# EAGLE design icyradio-exp-mmw-int-rf (EAGLE 9.6.2)
CREVISION: 1; DESIGNER: Joao Silva

## Sheet 1 of 3: Upconverter
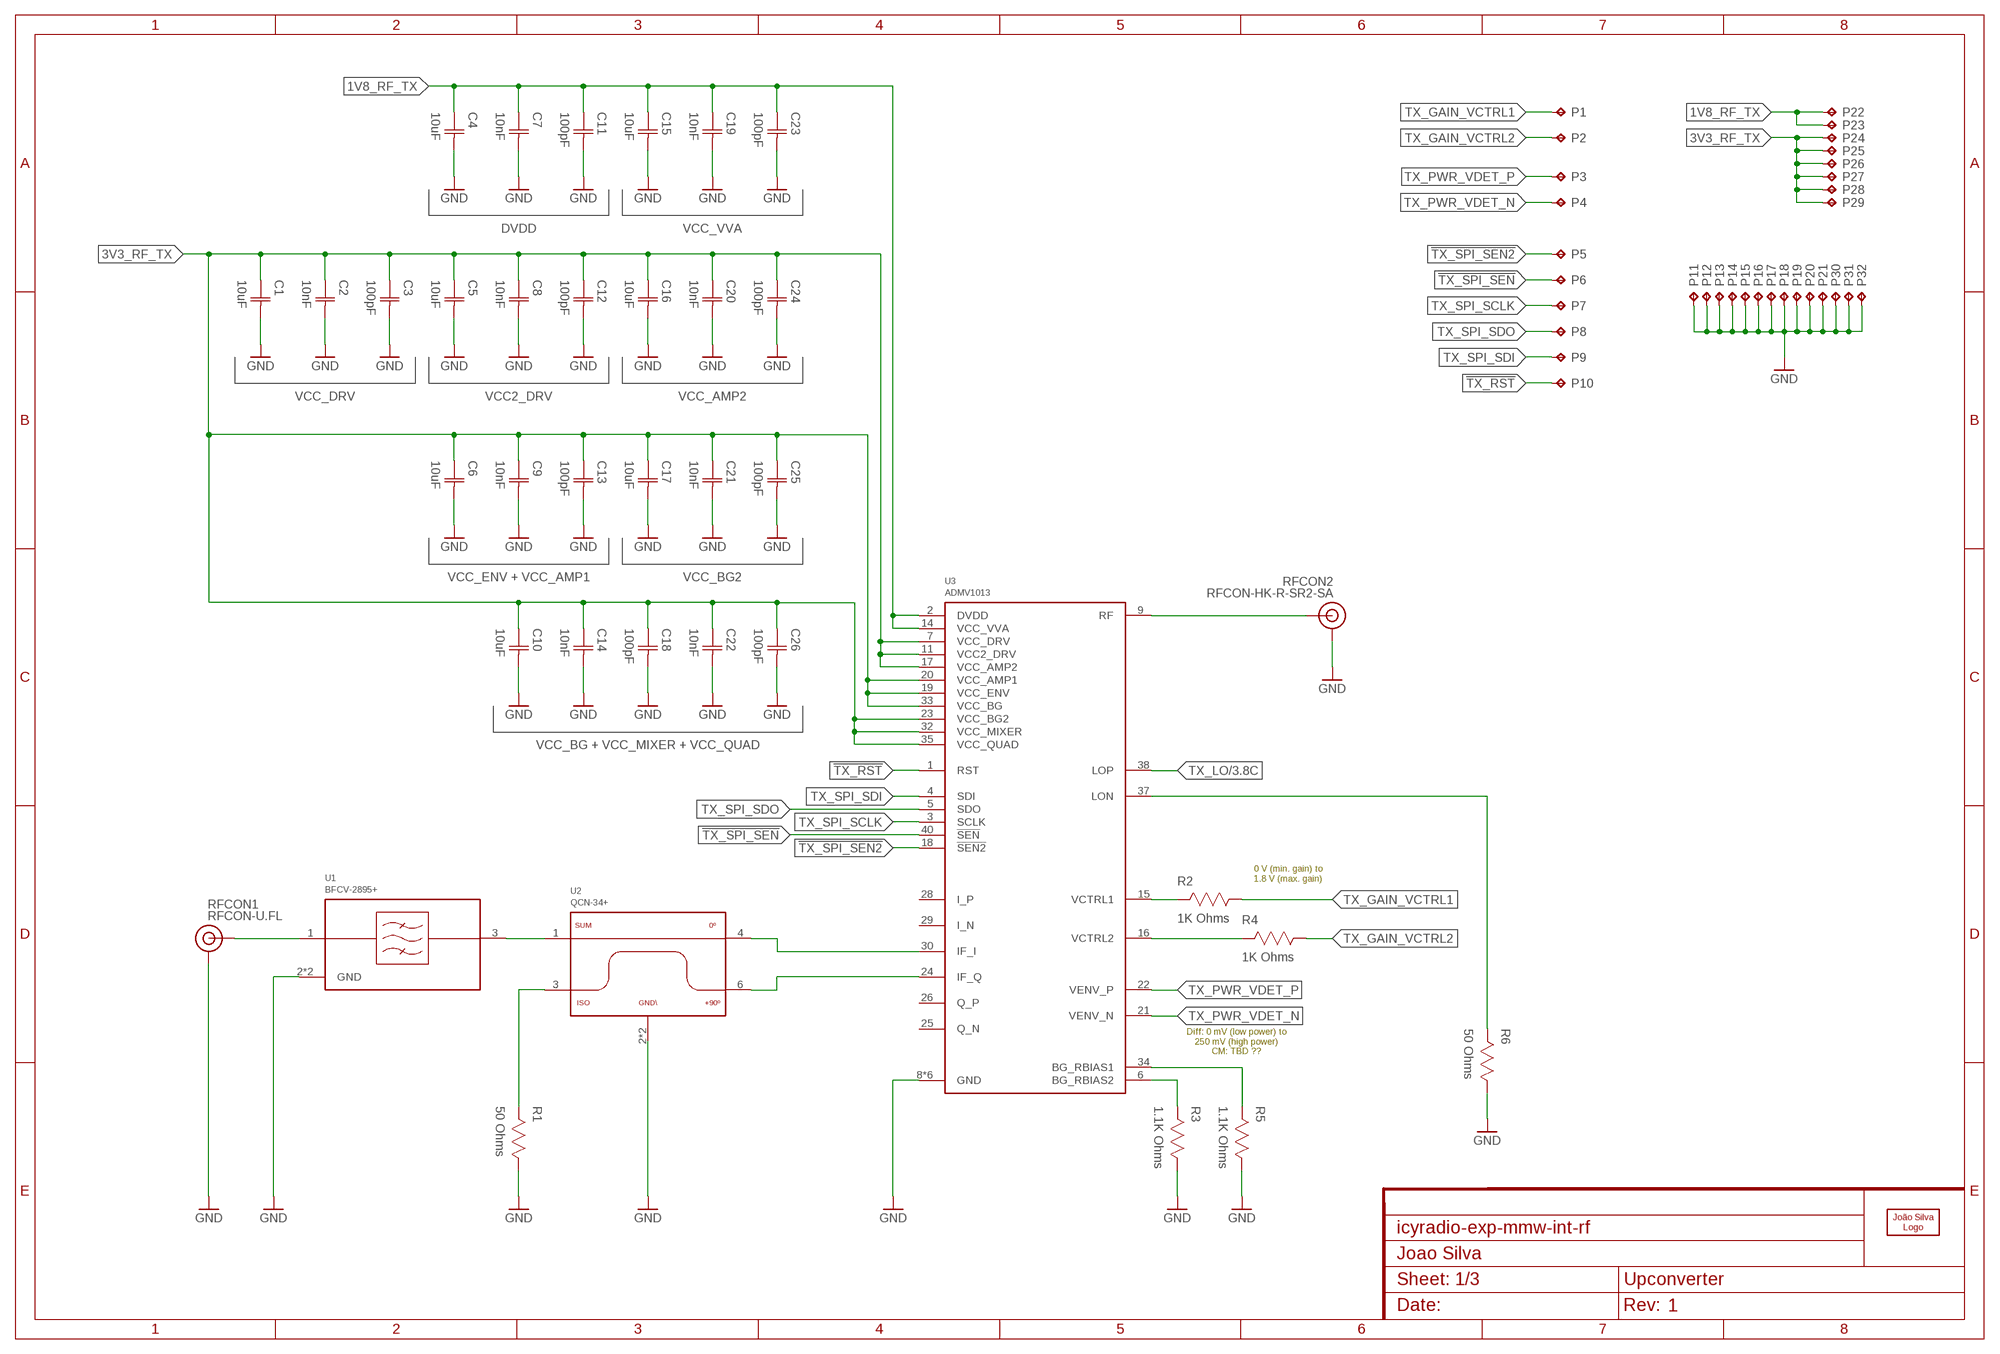
[diagram p0: schematic, sheet 1]

### Parts
C1  10uF  CAPACITOR-0402  [CAP0402]
C2  10nF  CAPACITOR-0402  [CAP0402]
C3  100pF  CAPACITOR-0402  [CAP0402]
C4  10uF  CAPACITOR-0402  [CAP0402]
C5  10uF  CAPACITOR-0402  [CAP0402]
C6  10uF  CAPACITOR-0402  [CAP0402]
C7  10nF  CAPACITOR-0402  [CAP0402]
C8  10nF  CAPACITOR-0402  [CAP0402]
C9  10nF  CAPACITOR-0402  [CAP0402]
C10  10uF  CAPACITOR-0402  [CAP0402]
C11  100pF  CAPACITOR-0402  [CAP0402]
C12  100pF  CAPACITOR-0402  [CAP0402]
C13  100pF  CAPACITOR-0402  [CAP0402]
C14  10nF  CAPACITOR-0402  [CAP0402]
C15  10uF  CAPACITOR-0402  [CAP0402]
C16  10uF  CAPACITOR-0402  [CAP0402]
C17  10uF  CAPACITOR-0402  [CAP0402]
C18  100pF  CAPACITOR-0402  [CAP0402]
C19  10nF  CAPACITOR-0402  [CAP0402]
C20  10nF  CAPACITOR-0402  [CAP0402]
C21  10nF  CAPACITOR-0402  [CAP0402]
C22  10nF  CAPACITOR-0402  [CAP0402]
C23  100pF  CAPACITOR-0402  [CAP0402]
C24  100pF  CAPACITOR-0402  [CAP0402]
C25  100pF  CAPACITOR-0402  [CAP0402]
C26  100pF  CAPACITOR-0402  [CAP0402]
LOGO1  JSILVA-5MM  [JSILVA_5MM]
P1  CHOLE-0.9MM-SS  [CAST_HOLE_0P9MM_SS]
P2  CHOLE-0.9MM-SS  [CAST_HOLE_0P9MM_SS]
P3  CHOLE-0.9MM-SS  [CAST_HOLE_0P9MM_SS]
P4  CHOLE-0.9MM-SS  [CAST_HOLE_0P9MM_SS]
P5  CHOLE-0.9MM-SS  [CAST_HOLE_0P9MM_SS]
P6  CHOLE-0.9MM-SS  [CAST_HOLE_0P9MM_SS]
P7  CHOLE-0.9MM-SS  [CAST_HOLE_0P9MM_SS]
P8  CHOLE-0.9MM-SS  [CAST_HOLE_0P9MM_SS]
P9  CHOLE-0.9MM-SS  [CAST_HOLE_0P9MM_SS]
P10  CHOLE-0.9MM-SS  [CAST_HOLE_0P9MM_SS]
P11  CHOLE-0.9MM-DS  [CAST_HOLE_0P9MM_DS]
P12  CHOLE-0.9MM-DS  [CAST_HOLE_0P9MM_DS]
P13  CHOLE-0.9MM-DS  [CAST_HOLE_0P9MM_DS]
P14  CHOLE-0.9MM-DS  [CAST_HOLE_0P9MM_DS]
P15  CHOLE-0.9MM-DS  [CAST_HOLE_0P9MM_DS]
P16  CHOLE-0.9MM-DS  [CAST_HOLE_0P9MM_DS]
P17  CHOLE-0.9MM-DS  [CAST_HOLE_0P9MM_DS]
P18  CHOLE-0.9MM-DS  [CAST_HOLE_0P9MM_DS]
P19  CHOLE-0.9MM-DS  [CAST_HOLE_0P9MM_DS]
P20  CHOLE-0.9MM-DS  [CAST_HOLE_0P9MM_DS]
P21  CHOLE-0.9MM-DS  [CAST_HOLE_0P9MM_DS]
P22  CHOLE-0.9MM-SS  [CAST_HOLE_0P9MM_SS]
P23  CHOLE-0.9MM-SS  [CAST_HOLE_0P9MM_SS]
P24  CHOLE-0.9MM-SS  [CAST_HOLE_0P9MM_SS]
P25  CHOLE-0.9MM-SS  [CAST_HOLE_0P9MM_SS]
P26  CHOLE-0.9MM-SS  [CAST_HOLE_0P9MM_SS]
P27  CHOLE-0.9MM-SS  [CAST_HOLE_0P9MM_SS]
P28  CHOLE-0.9MM-SS  [CAST_HOLE_0P9MM_SS]
P29  CHOLE-0.9MM-SS  [CAST_HOLE_0P9MM_SS]
P30  CHOLE-0.9MM-DS  [CAST_HOLE_0P9MM_DS]
P31  CHOLE-0.9MM-DS  [CAST_HOLE_0P9MM_DS]
P32  CHOLE-0.9MM-DS  [CAST_HOLE_0P9MM_DS]
R1  50 Ohms  RESISTOR-0402  [RES0402]
R2  1K Ohms  RESISTOR-0402  [RES0402]
R3  1.1K Ohms  RESISTOR-0402  [RES0402]
R4  1K Ohms  RESISTOR-0402  [RES0402]
R5  1.1K Ohms  RESISTOR-0402  [RES0402]
R6  50 Ohms  RESISTOR-0402  [RES0402]
RFCON1  RFCON-U.FL  [U.FL]
RFCON2  RFCON-HK-R-SR2-SA  [HK-R-SR2-SA]
U1  BFCV-2895+  [JV1210C]
U2  QCN-34+  [FV1206-1]
U3  ADMV1013  [LGA40]

### Nets
1V8_RF_TX: C4.1(C1) C7.1(C1) C11.1(C1) C15.1(C1) C19.1(C1) C23.1(C1) P22.PAD_T(TP) P23.PAD_T(TP) U3.2(DVDD) U3.14(VCC_VVA)
3V3_RF_TX: C1.1(C1) C2.1(C1) C3.1(C1) C5.1(C1) C6.1(C1) C8.1(C1) C9.1(C1) C10.1(C1) C12.1(C1) C13.1(C1) C14.1(C1) C16.1(C1) C17.1(C1) C18.1(C1) C20.1(C1) C21.1(C1) C22.1(C1) C24.1(C1) C25.1(C1) C26.1(C1) P24.PAD_T(TP) P25.PAD_T(TP) P26.PAD_T(TP) P27.PAD_T(TP) P28.PAD_T(TP) P29.PAD_T(TP) U3.7(VCC_DRV) U3.11(VCC2_DRV) U3.17(VCC_AMP2) U3.19(VCC_ENV) U3.20(VCC_AMP1) U3.23(VCC_BG2) U3.32(VCC_MIXER) U3.33(VCC_BG) U3.35(VCC_QUAD)
!TX_RST: P10.PAD_T(TP) U3.1(RST)
!TX_SPI_SEN: P6.PAD_T(TP) U3.40(!SEN)
!TX_SPI_SEN2: P5.PAD_T(TP) U3.18(!SEN2)
GND: C1.2(C2) C2.2(C2) C3.2(C2) C4.2(C2) C5.2(C2) C6.2(C2) C7.2(C2) C8.2(C2) C9.2(C2) C10.2(C2) C11.2(C2) C12.2(C2) C13.2(C2) C14.2(C2) C15.2(C2) C16.2(C2) C17.2(C2) C18.2(C2) C19.2(C2) C20.2(C2) C21.2(C2) C22.2(C2) C23.2(C2) C24.2(C2) C25.2(C2) C26.2(C2) P11.PAD_B(TP) P11.PAD_T(TP) P12.PAD_B(TP) P12.PAD_T(TP) P13.PAD_B(TP) P13.PAD_T(TP) P14.PAD_B(TP) P14.PAD_T(TP) P15.PAD_B(TP) P15.PAD_T(TP) P16.PAD_B(TP) P16.PAD_T(TP) P17.PAD_B(TP) P17.PAD_T(TP) P18.PAD_B(TP) P18.PAD_T(TP) P19.PAD_B(TP) P19.PAD_T(TP) P20.PAD_B(TP) P20.PAD_T(TP) P21.PAD_B(TP) P21.PAD_T(TP) P30.PAD_B(TP) P30.PAD_T(TP) P31.PAD_B(TP) P31.PAD_T(TP) P32.PAD_B(TP) P32.PAD_T(TP) R1.1 R3.1 R5.1 R6.1 RFCON1.P$1(GND) RFCON1.P$2(GND) RFCON2.GND@1(GND) RFCON2.GND@2(GND) U1.2(GND) U1.4(GND) U2.2(GND) U2.5(GND) U3.8(GND) U3.10(GND) U3.27(GND) U3.36(GND) U3.39(GND) U3.41(GND) ; also sheet 2,3
N$5: R3.2 U3.6(BG_RBIAS2)
N$6: R5.2 U3.34(BG_RBIAS1)
N$11: R1.2 U2.3(ISO)
N$17: R2.2 U3.15(VCTRL1)
N$18: R4.2 U3.16(VCTRL2)
TX_GAIN_VCTRL1: P1.PAD_T(TP) R2.1
TX_GAIN_VCTRL2: P2.PAD_T(TP) R4.1
TX_IF_FILT: U1.3(RFOUT) U2.1(SUM)
TX_IF_I: U2.4(0DEG) U3.30(IF_I)
TX_IF_IN: RFCON1.P$3(SIGNAL) U1.1(RFIN)
TX_IF_Q: U2.6(P90DEG) U3.24(IF_Q)
TX_LO: U3.38(LOP) ; also sheet 3
TX_LO_N: R6.2 U3.37(LON)
TX_PWR_VDET_N: P4.PAD_T(TP) U3.21(VENV_N)
TX_PWR_VDET_P: P3.PAD_T(TP) U3.22(VENV_P)
TX_RF: RFCON2.SIG(SIGNAL) U3.9(RF)
TX_SPI_SCLK: P7.PAD_T(TP) U3.3(SCLK)
TX_SPI_SDI: P9.PAD_T(TP) U3.4(SDI)
TX_SPI_SDO: P8.PAD_T(TP) U3.5(SDO)
Unconnected: U3.25(Q_N) U3.26(Q_P) U3.28(I_P) U3.29(I_N)

### Notes on the sheet
- DVDD | VCC_VVA
- VCC_DRV | VCC2_DRV | VCC_AMP2
- VCC_ENV + VCC_AMP1 | VCC_BG2
- VCC_BG + VCC_MIXER + VCC_QUAD
- 0 V (min. gain) to
  1.8 V (max. gain)
- Diff: 0 mV (low power) to
  250 mV (high power)
  CM: TBD ??

## Sheet 2 of 3: Downconverter
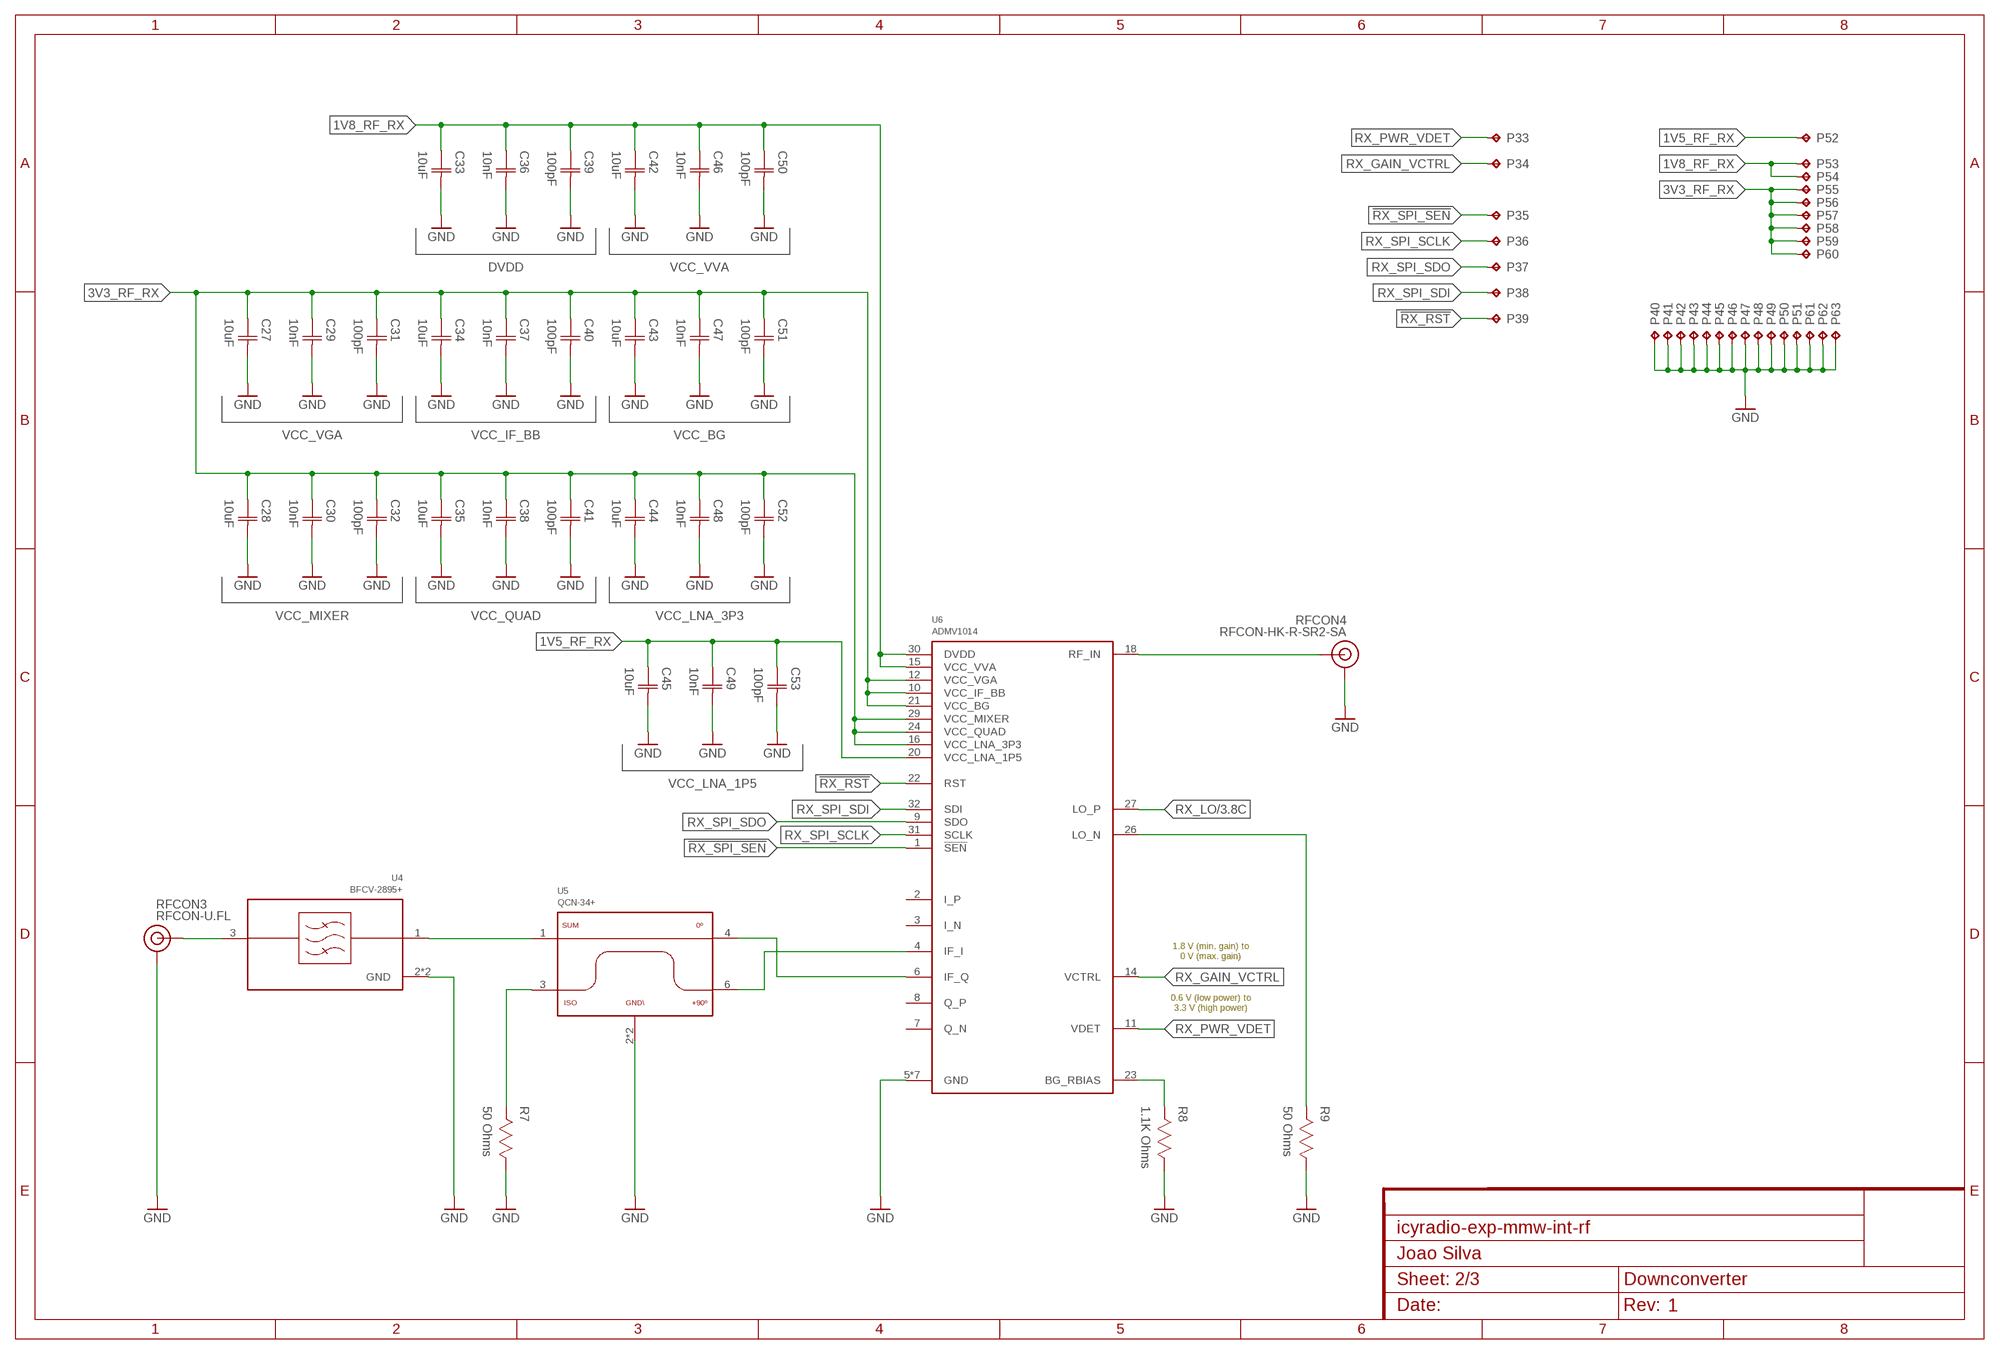
[diagram p1: schematic, sheet 2]

### Parts
C27  10uF  CAPACITOR-0402  [CAP0402]
C28  10uF  CAPACITOR-0402  [CAP0402]
C29  10nF  CAPACITOR-0402  [CAP0402]
C30  10nF  CAPACITOR-0402  [CAP0402]
C31  100pF  CAPACITOR-0402  [CAP0402]
C32  100pF  CAPACITOR-0402  [CAP0402]
C33  10uF  CAPACITOR-0402  [CAP0402]
C34  10uF  CAPACITOR-0402  [CAP0402]
C35  10uF  CAPACITOR-0402  [CAP0402]
C36  10nF  CAPACITOR-0402  [CAP0402]
C37  10nF  CAPACITOR-0402  [CAP0402]
C38  10nF  CAPACITOR-0402  [CAP0402]
C39  100pF  CAPACITOR-0402  [CAP0402]
C40  100pF  CAPACITOR-0402  [CAP0402]
C41  100pF  CAPACITOR-0402  [CAP0402]
C42  10uF  CAPACITOR-0402  [CAP0402]
C43  10uF  CAPACITOR-0402  [CAP0402]
C44  10uF  CAPACITOR-0402  [CAP0402]
C45  10uF  CAPACITOR-0402  [CAP0402]
C46  10nF  CAPACITOR-0402  [CAP0402]
C47  10nF  CAPACITOR-0402  [CAP0402]
C48  10nF  CAPACITOR-0402  [CAP0402]
C49  10nF  CAPACITOR-0402  [CAP0402]
C50  100pF  CAPACITOR-0402  [CAP0402]
C51  100pF  CAPACITOR-0402  [CAP0402]
C52  100pF  CAPACITOR-0402  [CAP0402]
C53  100pF  CAPACITOR-0402  [CAP0402]
P33  CHOLE-0.9MM-SS  [CAST_HOLE_0P9MM_SS]
P34  CHOLE-0.9MM-SS  [CAST_HOLE_0P9MM_SS]
P35  CHOLE-0.9MM-SS  [CAST_HOLE_0P9MM_SS]
P36  CHOLE-0.9MM-SS  [CAST_HOLE_0P9MM_SS]
P37  CHOLE-0.9MM-SS  [CAST_HOLE_0P9MM_SS]
P38  CHOLE-0.9MM-SS  [CAST_HOLE_0P9MM_SS]
P39  CHOLE-0.9MM-SS  [CAST_HOLE_0P9MM_SS]
P40  CHOLE-0.9MM-DS  [CAST_HOLE_0P9MM_DS]
P41  CHOLE-0.9MM-DS  [CAST_HOLE_0P9MM_DS]
P42  CHOLE-0.9MM-DS  [CAST_HOLE_0P9MM_DS]
P43  CHOLE-0.9MM-DS  [CAST_HOLE_0P9MM_DS]
P44  CHOLE-0.9MM-DS  [CAST_HOLE_0P9MM_DS]
P45  CHOLE-0.9MM-DS  [CAST_HOLE_0P9MM_DS]
P46  CHOLE-0.9MM-DS  [CAST_HOLE_0P9MM_DS]
P47  CHOLE-0.9MM-DS  [CAST_HOLE_0P9MM_DS]
P48  CHOLE-0.9MM-DS  [CAST_HOLE_0P9MM_DS]
P49  CHOLE-0.9MM-DS  [CAST_HOLE_0P9MM_DS]
P50  CHOLE-0.9MM-DS  [CAST_HOLE_0P9MM_DS]
P51  CHOLE-0.9MM-DS  [CAST_HOLE_0P9MM_DS]
P52  CHOLE-0.9MM-SS  [CAST_HOLE_0P9MM_SS]
P53  CHOLE-0.9MM-SS  [CAST_HOLE_0P9MM_SS]
P54  CHOLE-0.9MM-SS  [CAST_HOLE_0P9MM_SS]
P55  CHOLE-0.9MM-SS  [CAST_HOLE_0P9MM_SS]
P56  CHOLE-0.9MM-SS  [CAST_HOLE_0P9MM_SS]
P57  CHOLE-0.9MM-SS  [CAST_HOLE_0P9MM_SS]
P58  CHOLE-0.9MM-SS  [CAST_HOLE_0P9MM_SS]
P59  CHOLE-0.9MM-SS  [CAST_HOLE_0P9MM_SS]
P60  CHOLE-0.9MM-SS  [CAST_HOLE_0P9MM_SS]
P61  CHOLE-0.9MM-DS  [CAST_HOLE_0P9MM_DS]
P62  CHOLE-0.9MM-DS  [CAST_HOLE_0P9MM_DS]
P63  CHOLE-0.9MM-DS  [CAST_HOLE_0P9MM_DS]
R7  50 Ohms  RESISTOR-0402  [RES0402]
R8  1.1K Ohms  RESISTOR-0402  [RES0402]
R9  50 Ohms  RESISTOR-0402  [RES0402]
RFCON3  RFCON-U.FL  [U.FL]
RFCON4  RFCON-HK-R-SR2-SA  [HK-R-SR2-SA]
U4  BFCV-2895+  [JV1210C]
U5  QCN-34+  [FV1206-1]
U6  ADMV1014  [LGA32]

### Nets
1V5_RF_RX: C45.1(C1) C49.1(C1) C53.1(C1) P52.PAD_T(TP) U6.20(VCC_LNA_1P5)
1V8_RF_RX: C33.1(C1) C36.1(C1) C39.1(C1) C42.1(C1) C46.1(C1) C50.1(C1) P53.PAD_T(TP) P54.PAD_T(TP) U6.15(VCC_VVA) U6.30(DVDD)
3V3_RF_RX: C27.1(C1) C28.1(C1) C29.1(C1) C30.1(C1) C31.1(C1) C32.1(C1) C34.1(C1) C35.1(C1) C37.1(C1) C38.1(C1) C40.1(C1) C41.1(C1) C43.1(C1) C44.1(C1) C47.1(C1) C48.1(C1) C51.1(C1) C52.1(C1) P55.PAD_T(TP) P56.PAD_T(TP) P57.PAD_T(TP) P58.PAD_T(TP) P59.PAD_T(TP) P60.PAD_T(TP) U6.10(VCC_IF_BB) U6.12(VCC_VGA) U6.16(VCC_LNA_3P3) U6.21(VCC_BG) U6.24(VCC_QUAD) U6.29(VCC_MIXER)
!RX_RST: P39.PAD_T(TP) U6.22(RST)
!RX_SPI_SEN: P35.PAD_T(TP) U6.1(!SEN)
GND: C27.2(C2) C28.2(C2) C29.2(C2) C30.2(C2) C31.2(C2) C32.2(C2) C33.2(C2) C34.2(C2) C35.2(C2) C36.2(C2) C37.2(C2) C38.2(C2) C39.2(C2) C40.2(C2) C41.2(C2) C42.2(C2) C43.2(C2) C44.2(C2) C45.2(C2) C46.2(C2) C47.2(C2) C48.2(C2) C49.2(C2) C50.2(C2) C51.2(C2) C52.2(C2) C53.2(C2) P40.PAD_B(TP) P40.PAD_T(TP) P41.PAD_B(TP) P41.PAD_T(TP) P42.PAD_B(TP) P42.PAD_T(TP) P43.PAD_B(TP) P43.PAD_T(TP) P44.PAD_B(TP) P44.PAD_T(TP) P45.PAD_B(TP) P45.PAD_T(TP) P46.PAD_B(TP) P46.PAD_T(TP) P47.PAD_B(TP) P47.PAD_T(TP) P48.PAD_B(TP) P48.PAD_T(TP) P49.PAD_B(TP) P49.PAD_T(TP) P50.PAD_B(TP) P50.PAD_T(TP) P51.PAD_B(TP) P51.PAD_T(TP) P61.PAD_B(TP) P61.PAD_T(TP) P62.PAD_B(TP) P62.PAD_T(TP) P63.PAD_B(TP) P63.PAD_T(TP) R7.1 R8.1 R9.1 RFCON3.P$1(GND) RFCON3.P$2(GND) RFCON4.GND@1(GND) RFCON4.GND@2(GND) U4.2(GND) U4.4(GND) U5.2(GND) U5.5(GND) U6.5(GND) U6.13(GND) U6.17(GND) U6.19(GND) U6.25(GND) U6.28(GND) U6.33(GND) ; also sheet 1,3
N$9: R8.2 U6.23(BG_RBIAS)
N$13: R7.2 U5.3(ISO)
RX_GAIN_VCTRL: P34.PAD_T(TP) U6.14(VCTRL)
RX_IF: U4.1(RFIN) U5.1(SUM)
RX_IF_FILT: RFCON3.P$3(SIGNAL) U4.3(RFOUT)
RX_IF_I: U5.6(P90DEG) U6.4(IF_I)
RX_IF_Q: U5.4(0DEG) U6.6(IF_Q)
RX_LO: U6.27(LO_P) ; also sheet 3
RX_LO_N: R9.2 U6.26(LO_N)
RX_PWR_VDET: P33.PAD_T(TP) U6.11(VDET)
RX_RF: RFCON4.SIG(SIGNAL) U6.18(RF_IN)
RX_SPI_SCLK: P36.PAD_T(TP) U6.31(SCLK)
RX_SPI_SDI: P38.PAD_T(TP) U6.32(SDI)
RX_SPI_SDO: P37.PAD_T(TP) U6.9(SDO)
Unconnected: U6.2(I_P) U6.3(I_N) U6.7(Q_N) U6.8(Q_P)

### Notes on the sheet
- DVDD | VCC_VVA
- VCC_VGA | VCC_IF_BB | VCC_BG
- VCC_MIXER | VCC_QUAD | VCC_LNA_3P3
- VCC_LNA_1P5
- 1.8 V (min. gain) to
  0 V (max. gain)
- 0.6 V (low power) to
  3.3 V (high power)

## Sheet 3 of 3: LO Conditioning
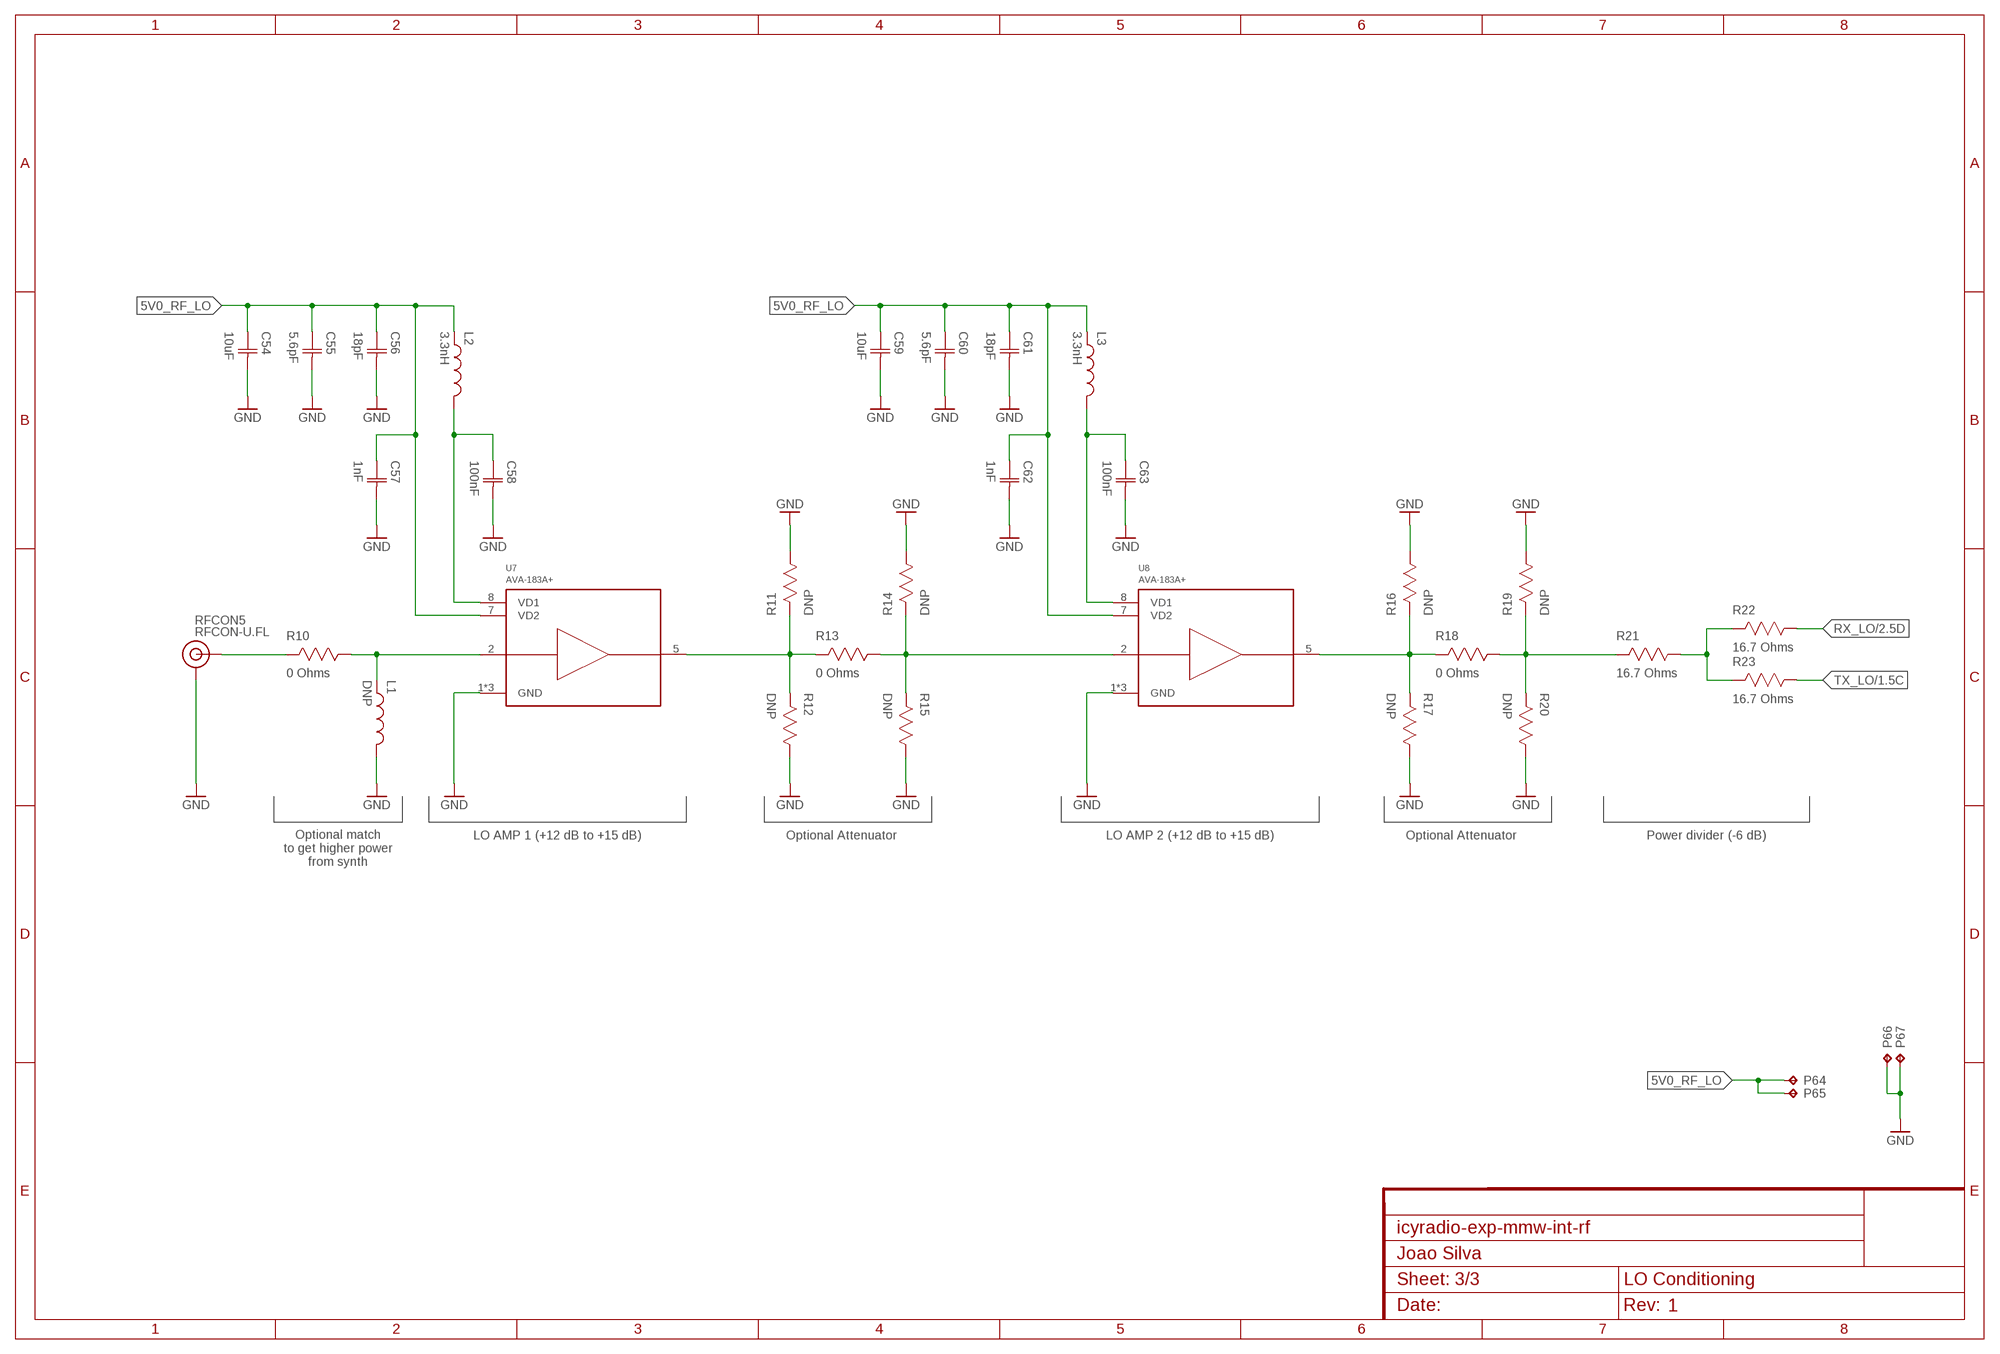
[diagram p2: schematic, sheet 3]

### Parts
C54  10uF  CAPACITOR-0402  [CAP0402]
C55  5.6pF  CAPACITOR-0402  [CAP0402]
C56  18pF  CAPACITOR-0402  [CAP0402]
C57  1nF  CAPACITOR-0402  [CAP0402]
C58  100nF  CAPACITOR-0402  [CAP0402]
C59  10uF  CAPACITOR-0402  [CAP0402]
C60  5.6pF  CAPACITOR-0402  [CAP0402]
C61  18pF  CAPACITOR-0402  [CAP0402]
C62  1nF  CAPACITOR-0402  [CAP0402]
C63  100nF  CAPACITOR-0402  [CAP0402]
L1  DNP  INDUCTOR-0402  [IND0402]
L2  3.3nH  INDUCTOR-0402  [IND0402]
L3  3.3nH  INDUCTOR-0402  [IND0402]
P64  CHOLE-0.9MM-SS  [CAST_HOLE_0P9MM_SS]
P65  CHOLE-0.9MM-SS  [CAST_HOLE_0P9MM_SS]
P66  CHOLE-0.9MM-DS  [CAST_HOLE_0P9MM_DS]
P67  CHOLE-0.9MM-DS  [CAST_HOLE_0P9MM_DS]
R10  0 Ohms  RESISTOR-0402  [RES0402]
R11  DNP  RESISTOR-0402  [RES0402]
R12  DNP  RESISTOR-0402  [RES0402]
R13  0 Ohms  RESISTOR-0402  [RES0402]
R14  DNP  RESISTOR-0402  [RES0402]
R15  DNP  RESISTOR-0402  [RES0402]
R16  DNP  RESISTOR-0402  [RES0402]
R17  DNP  RESISTOR-0402  [RES0402]
R18  0 Ohms  RESISTOR-0402  [RES0402]
R19  DNP  RESISTOR-0402  [RES0402]
R20  DNP  RESISTOR-0402  [RES0402]
R21  16.7 Ohms  RESISTOR-0402  [RES0402]
R22  16.7 Ohms  RESISTOR-0402  [RES0402]
R23  16.7 Ohms  RESISTOR-0402  [RES0402]
RFCON5  RFCON-U.FL  [U.FL]
U7  AVA-183A+  [DQ849]
U8  AVA-183A+  [DQ849]

### Nets
5V0_RF_LO: C54.1(C1) C55.1(C1) C56.1(C1) C57.1(C1) C59.1(C1) C60.1(C1) C61.1(C1) C62.1(C1) L2.1 L3.1 P64.PAD_T(TP) P65.PAD_T(TP) U7.7(VD2) U8.7(VD2)
GND: C54.2(C2) C55.2(C2) C56.2(C2) C57.2(C2) C58.2(C2) C59.2(C2) C60.2(C2) C61.2(C2) C62.2(C2) C63.2(C2) L1.2 P66.PAD_B(TP) P66.PAD_T(TP) P67.PAD_B(TP) P67.PAD_T(TP) R11.1 R12.1 R14.1 R15.1 R16.1 R17.1 R19.1 R20.1 RFCON5.P$1(GND) RFCON5.P$2(GND) U7.1(GND) U7.6(GND) U7.9(GND) U8.1(GND) U8.6(GND) U8.9(GND) ; also sheet 1,2
LO_AMP1_IN: L1.1 R10.1 U7.2(RFIN)
LO_AMP1_OUT: R11.2 R12.2 R13.2 U7.5(RFOUT)
LO_AMP2_IN: R13.1 R14.2 R15.2 U8.2(RFIN)
LO_AMP2_OUT: R16.2 R17.2 R18.2 U8.5(RFOUT)
LO_AMP_VD1: C58.1(C1) L2.2 U7.8(VD1)
LO_AMP_VD2: C63.1(C1) L3.2 U8.8(VD1)
LO_IN: R10.2 RFCON5.P$3(SIGNAL)
LO_OUT: R18.1 R19.2 R20.2 R21.2
LO_SPLIT: R21.1 R22.2 R23.2
RX_LO: R22.1 ; also sheet 2
TX_LO: R23.1 ; also sheet 1

### Notes on the sheet
- LO AMP 1 (+12 dB to +15 dB) | Optional Attenuator | LO AMP 2 (+12 dB to +15 dB) | Optional Attenuator | Power divider (-6 dB)
- Optional match
  to get higher power
  from synth

## Library data of the parts
C1-C63 = Capacitor:CAPACITOR
L1-L3 = Inductor:INDUCTOR; REF: 0402DC-3N3
LOGO1 = Silkscreen:JS
P1-P67 = PADs:CHOLE
R1-R23 = Resistor:RESISTOR
RFCON1-RFCON5 = RF Connector:RFCON
U1 U4 = Mini Circuits:BFCV-*+
U2 U5 = Mini Circuits:QCN-34*+
U3 = Analog Devices:ADMV1013
U6 = Analog Devices:ADMV1014
U7 U8 = Mini Circuits:AVA-183A+

## Net classes
1 CPWG 50 Ohm Single-Ended: width 0.2 mm, clearance 0.127 mm to class 0, clearance 0.127 mm

## Board
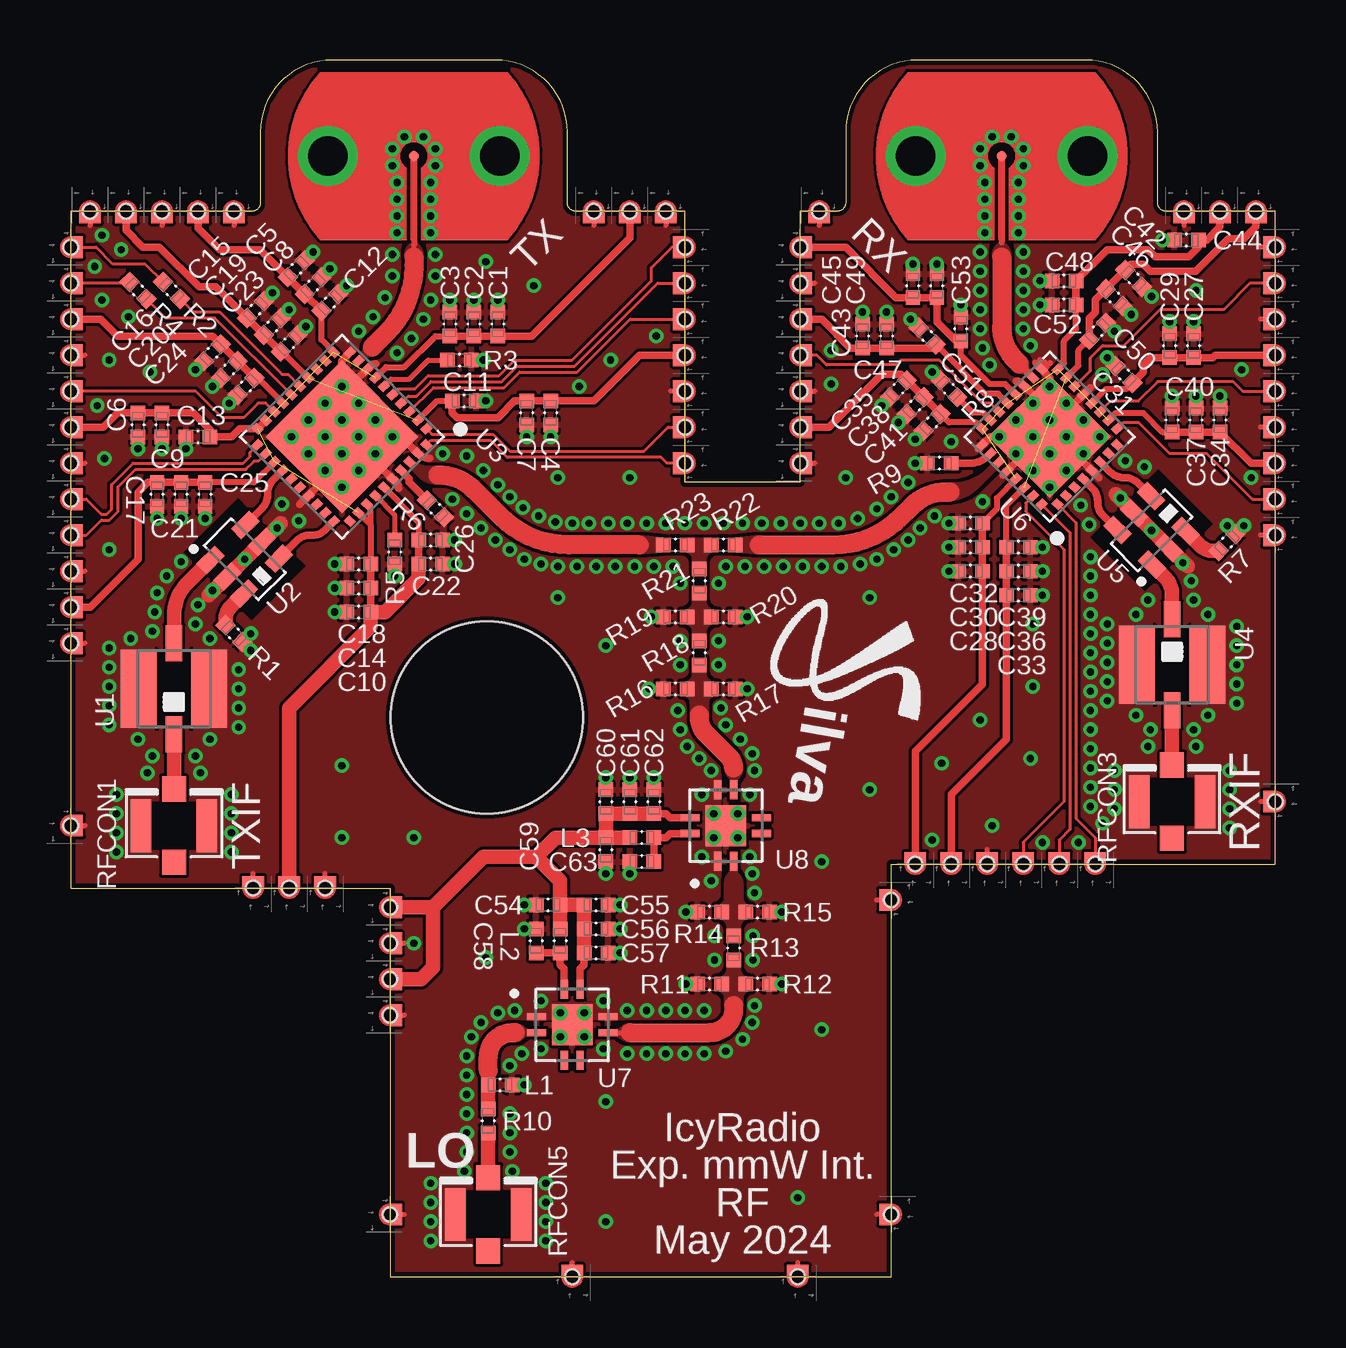
[diagram p3: board, top side]
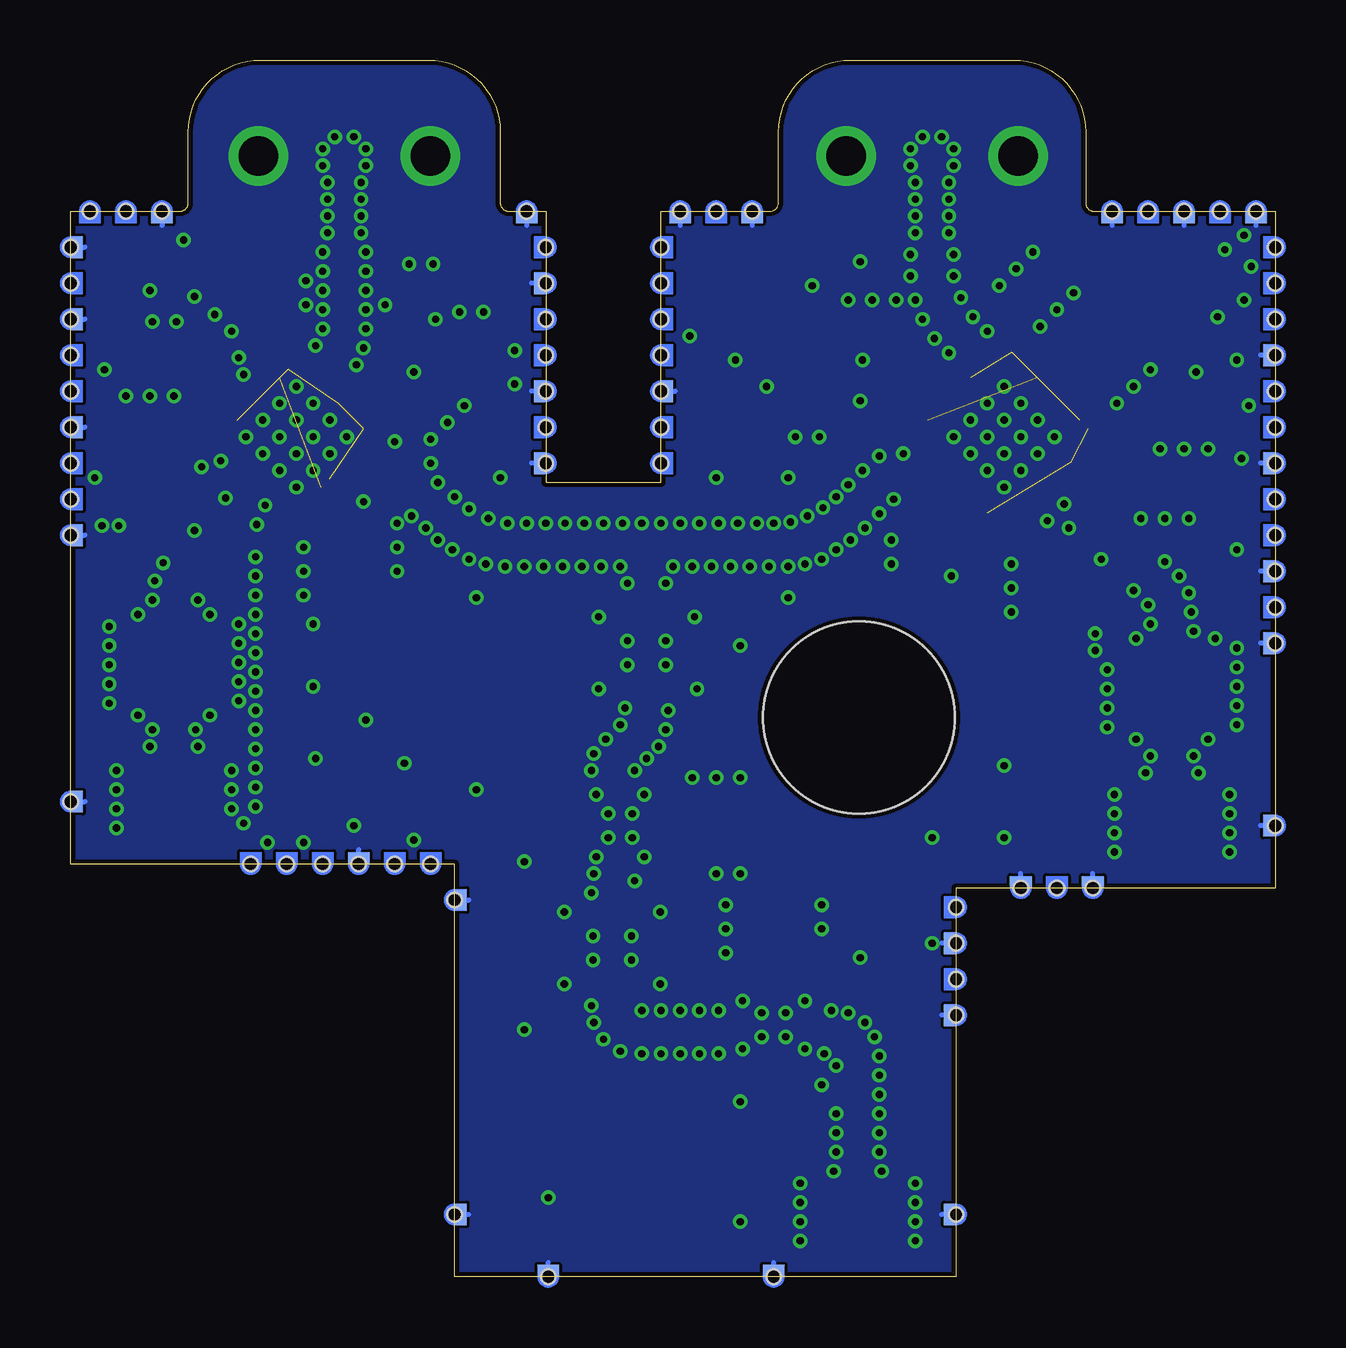
[diagram p4: board, bottom side, seen from below]

Size 50.2 x 50.7 mm. Coordinates in mm from the lower left corner, seen from the top.
Outline: 34.2,17.2 50.2,17.2 50.2,44.4 45.65,44.4 arc-90 45.3,44.75 45.3,47.7 arc90 42.3,50.7 35.3,50.7 arc90 32.3,47.7 32.3,44.75 arc-90 31.95,44.4 30.4,44.4 30.4,33.1 25.6,33.1 25.6,44.4 21.05,44.4 arc-90 20.7,44.75 20.7,47.7 arc90 17.7,50.7 10.9,50.7 arc90 7.9,47.7 7.9,44.75 arc-90 7.55,44.4 0,44.4 0,16.2 13.3,16.2 13.3,0 34.2,0 34.2,17.2
Copper layers (1*16): Top 0.035mm / dielectric 1.6mm / Bottom 0.035mm
Design rules "jlcpcb_2layer *": minimum track width 5mil, minimum drill 0.3mm, track to track 5mil, track to pad 5mil, pad to pad 5mil, via to via 5mil, smd to smd 5mil, copper to edge 0.2mm, drill to drill 5mil, minimum pad ring 0.15mm, minimum via ring 0.15mm, stop-mask expansion 0.04mm, vias tented up to drill 10mm, thermal gap 5mil
Holes 8 mm at 17.35,23.3
tRestrict: area 14.8,31.6 to 15.6,32.4; area 36,33.5 to 36.4,34.3; area 6.4,26.4 to 7.2,27.2; area 47.8,30.2 to 48.6,31; area 21.7,13.1 to 22.1,13.9; area 21.7,14.1 to 22.1,14.9; area 21.7,15.1 to 22.1,15.9; area 19.7,15.1 to 20.1,15.9; area 20,13.8 to 20.8,14.2; area 19,13.8 to 19.8,14.2; area 23.9,19.6 to 24.7,20; area 22.9,19.6 to 23.7,20; 7 more areas

### Footprints (pad centres in the part's own frame; a part is rotated, then mirrored left to right if it is on the bottom)
CAP0402 = smd 0.6 x 0.6: 1 -0.5,0; 2 0.5,0
IND0402 = smd 0.6 x 0.6: 1 -0.5,0; 2 0.5,0
CAST_HOLE_0P9MM_SS = smd 0.5 x 0.9: PAD_T 0.25,0 | hole 0.6: 0,0
CAST_HOLE_0P9MM_DS = smd 0.5 x 0.9 bottom: PAD_B 0.25,0 | smd 0.5 x 0.9: PAD_T 0.25,0 | hole 0.6: 0,0
RES0402 = smd 0.6 x 0.6: 1 -0.5,0; 2 0.5,0
U.FL = smd 2.2 x 0.85: P$1 0,1.375; P$2 0,-1.375 | smd 1.05 x 1: P$3 1.525,0; P$4 -1.525,0
HK-R-SR2-SA = drill 1.65: GND@1 -3.58,0; GND@2 3.58,0 | smd 0.41 x 0.41: SIG 0,0
JV1210C = smd 1.5 x 0.7: 1 -1.9,0; 3 1.9,0 | smd 3.25 x 1.5: 2 0,-1.475; 4 0,1.475
FV1206-1 = smd 0.61 x 1.07: 1 -0.99,-1.025; 2 0,-1.025; 3 0.99,-1.025; 4 0.99,1.025; 5 0,1.025; 6 -0.99,1.025
LGA40 = smd 0.4 x 0.32: 1 -2.725,2.25; 2 -2.725,1.75; 3 -2.725,1.25; 4 -2.725,0.75; 5 -2.725,0.25; 6 -2.725,-0.25; 7 -2.725,-0.75; 8 -2.725,-1.25; 9 -2.725,-1.75; 10 -2.725,-2.25; 21 2.725,-2.25; 22 2.725,-1.75; 23 2.725,-1.25; 24 2.725,-0.75; 25 2.725,-0.25; 26 2.725,0.25; 27 2.725,0.75; 28 2.725,1.25; 29 2.725,1.75; 30 2.725,2.25 | smd 0.32 x 0.4: 11 -2.25,-2.725; 12 -1.75,-2.725; 13 -1.25,-2.725; 14 -0.75,-2.725; 15 -0.25,-2.725; 16 0.25,-2.725; 17 0.75,-2.725; 18 1.25,-2.725; 19 1.75,-2.725; 20 2.25,-2.725; 31 2.25,2.725; 32 1.75,2.725; 33 1.25,2.725; 34 0.75,2.725; 35 0.25,2.725; 36 -0.25,2.725; 37 -0.75,2.725; 38 -1.25,2.725; 39 -1.75,2.725; 40 -2.25,2.725 | smd 4.5 x 4.5: 41 0,0
LGA32 = smd 0.4 x 0.32: 1 -2.225,1.75; 2 -2.225,1.25; 3 -2.225,0.75; 4 -2.225,0.25; 5 -2.225,-0.25; 6 -2.225,-0.75; 7 -2.225,-1.25; 8 -2.225,-1.75; 17 2.225,-1.75; 18 2.225,-1.25; 19 2.225,-0.75; 20 2.225,-0.25; 21 2.225,0.25; 22 2.225,0.75; 23 2.225,1.25; 24 2.225,1.75 | smd 0.32 x 0.4: 9 -1.75,-2.225; 10 -1.25,-2.225; 11 -0.75,-2.225; 12 -0.25,-2.225; 13 0.25,-2.225; 14 0.75,-2.225; 15 1.25,-2.225; 16 1.75,-2.225; 25 1.75,2.225; 26 1.25,2.225; 27 0.75,2.225; 28 0.25,2.225; 29 -0.25,2.225; 30 -0.75,2.225; 31 -1.25,2.225; 32 -1.75,2.225 | smd 3.6 x 3.6: 33 0,0
DQ849 = smd 0.79 x 0.3: 1 -1.485,0.33; 2 -1.485,-0.33; 5 1.485,-0.33; 6 1.485,0.33 | smd 0.3 x 0.79: 3 -0.33,-1.485; 4 0.33,-1.485; 7 0.33,1.485; 8 -0.33,1.485 | smd 1.7 x 1.7: 9 0,0

### Placement (x,y rotation side)
C1  17.8,39.7 90 top
C2  16.8,39.7 90 top
C3  15.8,39.7 90 top
C4  20,36 270 top
C5  9.4,42 45 top
C6  2.8,35.5 270 top
C7  19,36 270 top
C8  10.1,41.3 45 top
C9  3.8,35.5 270 top
C10  12,27.7 180 top
C11  16.4,36.5 0 top
C12  10.8,40.6 45 top
C13  5.3,35 180 top
C14  12,28.7 180 top
C15  7.7,40.3 45 top
C16  5.9,38.5 225 top
C17  3.6,32.6 270 top
C18  12,29.7 180 top
C19  8.4,39.6 45 top
C20  6.6,37.8 225 top
C21  4.6,32.6 270 top
C22  15,29.7 0 top
C23  9.1,38.9 45 top
C24  7.3,37.1 225 top
C25  5.6,32.6 270 top
C26  15,30.7 0 top
C27  46.8,38.8 90 top
C28  37.5,29.4 180 top
C29  45.8,38.8 90 top
C30  37.5,30.4 180 top
C31  43.9,37.6 135 top
C32  37.5,31.4 180 top
C33  39.5,28.4 0 top
C34  47.9,35.7 90 top
C35  34.5,37 225 top
C36  39.5,29.4 0 top
C37  46.9,35.7 90 top
C38  35.2,36.3 225 top
C39  39.5,30.4 0 top
C40  45.9,35.7 90 top
C41  35.9,35.6 225 top
C42  44.3,41.6 315 top
C43  33,39.2 90 top
C44  46.5,43.2 180 top
C45  35.1,41.3 90 top
C46  43.5,40.8 315 top
C47  34,39.2 90 top
C48  41.4,41.5 180 top
C49  36.1,41.3 90 top
C50  42.8,39.4 45 top
C51  35.7,39.2 135 top
C52  41.4,40.5 180 top
C53  37.1,39.5 90 top
C54  19.9,15.5 180 top
C55  21.9,15.5 0 top
C56  21.9,14.5 0 top
C57  21.9,13.5 0 top
C58  19.4,14 90 top
C59  22.3,17.8 270 top
C60  22.3,19.8 90 top
C61  23.3,19.8 90 top
C62  24.3,19.8 90 top
C63  23.8,17.3 180 top
L1  17.9,8 0 top
L2  20.4,14 270 top
L3  23.8,18.3 0 top
LOGO1  35.6,23 270 top
P1  0,42.9 0 top
P2  0,41.4 0 top
P3  0,30.9 0 top
P4  0,32.4 0 top
P5  0,36.9 0 top
P6  25.6,33.9 180 top
P7  25.6,39.9 180 top
P8  25.6,42.9 180 top
P9  25.6,41.4 180 top
P10  25.6,35.4 180 top
P11  24.8,44.4 270 top
P12  0,18.8 0 top
P13  25.6,36.9 180 top
P14  30.4,36.9 0 top
P15  0,29.4 0 top
P16  0.8,44.4 270 top
P17  21.8,44.4 270 top
P18  7.6,16.2 90 top
P19  34.2,15.7 180 top
P20  0,26.4 0 top
P21  0,33.9 0 top
P22  25.6,38.4 180 top
P23  2.3,44.4 270 top
P24  0,35.4 0 top
P25  5.3,44.4 270 top
P26  0,39.9 0 top
P27  0,27.9 0 top
P28  9.1,16.2 90 top
P29  23.3,44.4 270 top
P30  6.8,44.4 270 top
P31  0,38.4 0 top
P32  3.8,44.4 270 top
P33  50.2,36.9 180 top
P34  50.2,41.4 180 top
P35  42.7,17.2 90 top
P36  39.7,17.2 90 top
P37  50.2,32.4 180 top
P38  41.2,17.2 90 top
P39  30.4,38.4 0 top
P40  13.3,2.6 0 top
P41  38.2,17.2 90 top
P42  50.2,30.9 180 top
P43  50.2,19.8 180 top
P44  10.6,16.2 90 top
P45  31.2,44.4 270 top
P46  30.3,0 90 top
P47  34.2,2.6 180 top
P48  50.2,35.4 180 top
P49  46.4,44.4 270 top
P50  50.2,39.9 180 top
P51  50.2,42.9 180 top
P52  30.4,42.9 0 top
P53  49.4,44.4 270 top
P54  36.7,17.2 90 top
P55  50.2,33.9 180 top
P56  30.4,39.9 0 top
P57  35.2,17.2 90 top
P58  30.4,35.4 0 top
P59  47.9,44.4 270 top
P60  50.2,38.4 180 top
P61  30.4,33.9 0 top
P62  30.4,41.4 0 top
P63  20.9,0 90 top
P64  13.3,12.4 0 top
P65  13.3,15.4 0 top
P66  13.3,13.9 0 top
P67  13.3,10.9 0 top
R1  6.8,26.8 135 top
R2  4.2,41.1 315 top
R3  16.2,38.2 180 top
R4  2.8,41.1 315 top
R5  13.5,30.2 90 top
R6  15.2,32 135 top
R7  48.2,30.6 225 top
R8  36.6,37 315 top
R9  36.2,33.9 0 top
R10  17.4,6.5 270 top
R11  26.63,12.2 0 top
R12  28.63,12.2 180 top
R13  27.63,13.7 270 top
R14  26.63,15.2 0 top
R15  28.63,15.2 180 top
R16  25.2,24.5 0 top
R17  27.2,24.5 180 top
R18  26.2,26 270 top
R19  25.2,27.5 0 top
R20  27.2,27.5 180 top
R21  26.2,29 270 top
R22  27.2,30.5 180 top
R23  25.2,30.5 0 top
RFCON1  4.3,18.8 90 top
RFCON2  14.3,46.7 0 top
RFCON3  45.9,19.8 90 top
RFCON4  38.8,46.7 0 top
RFCON5  17.4,2.6 90 top
U1  4.3,24.5 90 top
U2  7.25,29.9 315 top
U3  11.3,35 225 top
U4  45.9,25.5 270 top
U5  45.05,31.1 45 top
U6  40.8,35 135 top
U7  20.9,10.5 0 top
U8  27.3,18.8 90 top

### Tracks (layer width: path | path; a pad name or v marks a point on that pad's centre or on a via)
1V5_RF_RX
  Top 0.254: U6.20 38.95,37.2 38.3,37.2 37.1,38.4 C53.1
  Top 0.305: C53.1 36.9,39 36.1,39.8 C49.1 C45.1 34.4,40.8 32.3,42.9 P52.PAD_T
1V8_RF_RX  (1 unrouted)
  Top 0.254: U6.15 42,37.97 42,38.6 C50.1 | C39.1 39,32.14 U6.30
  Top 0.305: C50.1 42.45,39.95 42.7,40.2 42.7,40.71 C46.1 C42.1 44.19,42.2 44.7,42.2 45,41.9 46.9,41.9 48.25,43.25 48.9,43.25 49.4,43.75 P53.PAD_T | C39.1 C36.1 C33.1 39,22.4 36.7,20.1 P54.PAD_T
1V8_RF_TX  (1 unrouted)
  Top 0.254: U3.14 8.81,38.55 C23.1 | U3.2 15.28,36.5 C11.1
  Top 0.305: C23.1 C19.1 C15.1 6.05,41.25 5.35,41.25 3.69,42.9 3,42.9 2.3,43.6 P23.PAD_T | C11.1 15.9,36 16.1,35.8 17.8,35.8 18.5,36.5 C7.1 C4.1 21.8,36.5 23.7,38.4 P22.PAD_T
3V3_RF_RX  (5 unrouted)
  Top 0.254: U6.12 43.15,37 44.01,37 C31.1 | U6.16 41.4,38.08 41.4,39 41.9,39.5 C52.1 | U6.24 37.72,35.6 36.61,35.6 C41.1 | U6.21 38.65,36.8 38.1,36.8 C51.1 | C32.1 38.6,32 38.6,32.45 U6.29 | U6.10 43.57,36 44.7,36 45.5,35.2 C40.1
  Top 0.305: C52.1 C48.1 43.2,42.8 44.9,42.8 45.2,42.5 46.6,42.5 47,42.9 C44.1 47.35,43.2 47.9,43.75 P59.PAD_T | C51.1 35.91,38.7 C47.1 C43.1 32.5,38.7 31.3,39.9 P56.PAD_T | C41.1 C38.1 C35.1 34.61,37.6 33.8,37.6 31.6,35.4 P58.PAD_T | C32.1 C30.1 C28.1 38,24.7 35.2,21.9 P57.PAD_T | C31.1 44.7,37.69 44.7,38 45,38.3 C29.1 C27.1 47.6,38.3 47.7,38.4 P60.PAD_T | C40.1 C37.1 C34.1 49.2,33.9 P55.PAD_T
3V3_RF_TX  (5 unrouted)
  Top 0.254: U3.7 13.14,37.9 13.9,37.9 15.2,39.2 C3.1 | C12.1 10.45,39.04 U3.11 | U3.17 7.79,37.45 C24.1 | U3.23 7.63,33.1 C25.1 | U3.33 12.5,32.03 12.5,31.33 | U3.32 12.5,31.33 | 12.5,31.33 C18.1 | U3.35 14.5,31.45 C26.1
  Top 0.305: 16.86,39.06 C2.1 | C2.1 C3.1 | C12.1 C8.1 C5.1 7.89,42.8 6.2,42.8 5.3,43.7 P25.PAD_T | C24.1 C20.1 C16.1 5.91,39.2 1.95,39.2 1.25,39.9 P26.PAD_T | C26.1 C22.1 | C10.1 C14.1 C18.1 | P27.PAD_T 0.8,27.9 2.8,29.9 2.8,32.7 3.2,33.1 C17.1 C21.1 C25.1 | C2.1 C1.1 19.2,39.2 23.3,43.3 P29.PAD_T | P24.PAD_T 1.35,35.4 1.95,36 C6.1 C9.1 5.1,36 5.8,35.3 C13.1 6.7,35 7.04,35.34 U3.20 U3.19
  Top 0.6: C22.1 14.5,29.1 13.1,27.7 C10.1 12.5,27.1 9.1,23.7 P28.PAD_T
5V0_RF_LO
  Top 0.305: C57.1 21.4,13 21.23,12.83 U7.7 | C62.1 24.8,19.3 24.97,19.13 U8.7
  Top 0.6: C59.1 C60.1 C61.1 C62.1 | C59.1 L3.1 | C54.1 C55.1 C56.1 C57.1 | C54.1 L2.1 | C59.1 20.2,18.3 19.4,17.5 | 19.4,17.5 17.2,17.5 15.1,15.4 | 15.1,15.4 P65.PAD_T | P64.PAD_T 14.6,12.4 15.1,12.9 15.1,15.4 | 19.4,17.5 20.4,16.5 C54.1
!RX_RST
  Top 0.127: U6.22 38.34,36.4 38,36.4 36.2,38.2 34.6,38.2 34.4,38 31.5,38 31.1,38.4 P39.PAD_T
!RX_SPI_SEN
  Top 0.127: U6.1 41.9,31.42 41.9,19.1 42.7,18.3 P35.PAD_T
!TX_RST
  Top 0.127: U3.1 15.05,35.1 17.6,35.1 18.3,34.4 23.9,34.4 24.9,35.4 P10.PAD_T
!TX_SPI_SEN
  Top 0.127: U3.40 15,34.85 17.5,34.85 18.2,34.15 24.6,34.15 24.85,33.9 P6.PAD_T
!TX_SPI_SEN2
  Top 0.127: U3.18 8.13,36.4 7.8,36.4 7.2,35.8 6.3,35.8 5.2,36.9 P5.PAD_T
GND  (via drill 0.3)
  Top 0.2: P17.PAD_T 21.8,43.8 | P11.PAD_T 24.8,43.8 | P13.PAD_T 25,36.9 | P61.PAD_T 31,33.9 | P14.PAD_T 31,36.9 | P62.PAD_T 31,41.4 | P45.PAD_T 31.2,43.8 | P49.PAD_T 46.4,43.8 | P51.PAD_T 49.6,42.9 | P50.PAD_T 49.6,39.9 | P48.PAD_T 49.6,35.4 | P42.PAD_T 49.6,30.9 | P43.PAD_T 49.6,19.8 | P41.PAD_B 38.2,17.8 | P19.PAD_T 33.6,15.7 | P47.PAD_T 33.6,2.6 | P46.PAD_B 30.3,0.6 | P63.PAD_B 20.9,0.6 | P40.PAD_B 13.9,2.6 | P67.PAD_B 13.9,10.9 | P66.PAD_B 13.9,13.9 | P44.PAD_T 10.6,16.8 | P18.PAD_T 7.6,16.8 | P12.PAD_T 0.6,18.8 | P20.PAD_T 0.6,26.4 | P15.PAD_T 0.6,29.4 | P21.PAD_T 0.6,33.9 | P31.PAD_T 0.6,38.4 | P16.PAD_T 0.8,43.8 | P30.PAD_T 6.8,43.8 | P32.PAD_T 3.8,43.8 | U3.41 v10.6,35 | U6.33 v41.5,35 | U8.9 v27.8,19.3 | U7.9 v21.4,11
  Top 0.254: U3.27 | U6.17 40.2,38.08 40.2,38.1 | U6.17 40.4,37.88 40.4,38.2 | U6.17 40.46,37.96 40.6,38.1 | U6.17 40.55,37.81 40.82,38.08
  Top 0.3: 26.97,18.17 27,18.2 | 26.97,19.47 26.9,19.4
  Top 0.305: U3.8 12.56,38.03 12.7,38.03 12.7,38.04 | 14.95,34.1 arc-45 U3.39 13.78,35 | 13.66,32.86 13.65,32.87 13.65,33 U3.36 13,33.65 | U3.8 11.88,37.35 11.8,37.35 | U3.10 11.5,38.38 11.5,38.37 11.28,38.16 11.28,37.88 | 9.53,32.18 9.54,32.18 U3.27 10.36,33 10.37,33 | 41.65,36.2 U6.13 42.5,37.05 | U6.17 40.6,37.67 40.8,37.47 v40.8,37.1 | 40.2,36.66 U6.19 39.63,37.23 arc45 39.41,37.32 | v38.7,35 38.33,35 38.13,34.8 U6.25 37.83,34.5 | 39.5,34.05 U6.28 38.85,33.4 | 42.1,34.05 U6.5 42.85,33.3 | v11.3,37.1 U3.41 11.3,36.77 U3.8
  Top 0.61: 5.75,28.4 U2.2 U2.5 8.75,31.4 | 46.55,29.6 43.55,32.6
  Bottom 0.2: P17.PAD_T 21.8,43.8 | P11.PAD_T 24.8,43.8 | P13.PAD_T 25,36.9 | P61.PAD_T 31,33.9 | P14.PAD_T 31,36.9 | P62.PAD_T 31,41.4 | P45.PAD_T 31.2,43.8 | P49.PAD_T 46.4,43.8 | P51.PAD_T 49.6,42.9 | P50.PAD_T 49.6,39.9 | P48.PAD_T 49.6,35.4 | P42.PAD_T 49.6,30.9 | P43.PAD_T 49.6,19.8 | P41.PAD_B 38.2,17.8 | P19.PAD_T 33.6,15.7 | P47.PAD_T 33.6,2.6 | P46.PAD_B 30.3,0.6 | P63.PAD_B 20.9,0.6 | P40.PAD_B 13.9,2.6 | P67.PAD_B 13.9,10.9 | P66.PAD_B 13.9,13.9 | P44.PAD_T 10.6,16.8 | P18.PAD_T 7.6,16.8 | P12.PAD_T 0.6,18.8 | P20.PAD_T 0.6,26.4 | P15.PAD_T 0.6,29.4 | P21.PAD_T 0.6,33.9 | P31.PAD_T 0.6,38.4 | P16.PAD_T 0.8,43.8 | P32.PAD_T 3.8,43.8 | P30.PAD_T 6.8,43.8
  other vias: 13.6,38.5 14.2,39.1 14.7,39.9 15,40.7 9.8,39.6 9.1,40.3 8.4,41 5.2,37.8 5.9,37.1 6.6,36.4 3.6,31.6 4.6,31.6 5.6,31.6 15.9,32.4 15.5,34.3 20,35 19,35 17.3,36.5 17.2,38.2 17.2,33.6 16.5,34.2 2.8,34.5 3.8,34.5 4.8,34.5 11.5,41.3 10.8,42 10.1,42.7 13.5,29.2 11,27.7 11,28.7 11,29.7 16,29.7 16,30.7 17.8,40.7 16.8,40.7 1.4,34.1 1.6,30.3 2.1,42.8 1.3,43.4 1,42.1 1.3,40.7 2.4,40 3.3,37.7 1.6,38.2 15.8,40.7 12,39.4 12.6,40 13.1,40.8 13.4,41.7 13.4,42.6 15.2,41.7 15.2,42.6 13.4,47 13.9,47.5 14.7,47.5 15.2,47 15.2,46.3 15,45.6 13.6,45.6 13.4,46.3 13.6,44.9 13.6,44.2 13.6,43.5 15,44.9 15,44.2 15,43.5 10.6,36.4 9.9,35.7 9.2,35 13.4,35 12.7,34.3 12,33.6 11.3,32.9 12.7,35.7 12,35 11.3,34.3 10.6,33.6 12,36.4 11.3,35.7 9.9,34.3 40.1,36.4 39.4,35.7 42.9,35 42.2,34.3 41.5,33.6 40.8,32.9 42.2,35.7 40.8,34.3 40.1,33.6 41.5,36.4 40.8,35.7 40.1,35 39.4,34.3 16.5,31.8 17.1,31.2 17.8,33 18.3,32.5 9.5,31.5 8.8,32.2 8.6,31.2 3.4,26.9 3.5,27.7 5.2,27.2 5.3,28 4,29.2 4.6,29.8 3.6,28.5 5.9,28.6 7.25,29.9 47.9,36.7 46.9,36.7 45.9,36.7 45.8,39.8 46.8,39.8 43.2,38.3 45.05,40.85 46.9,41.1 40.4,41.5 40.4,40.5 45.5,43.2 43,37.6 35,39.9 35.9,37.7 38.3,38 38,38.7 37.9,41.9 37.9,41.1 37.9,40.3 37.9,39.5 37.1,40.5 36.1,42.2 35.1,42.2 34,40.2 33,40.2 35.2,34.9 34.5,35.6 33.8,36.3 37.9,47 38.4,47.5 39.2,47.5 39.7,47 39.7,46.3 39.5,45.6 38.1,45.6 37.9,46.3 38.1,44.9 38.1,44.2 38.1,43.5 39.5,44.9 39.5,44.2 39.5,43.5 40,38.8 39.7,39.5 39.7,40.3 39.7,41.1 39.7,41.9 39.7,42.7 37.9,42.7 40.5,30.4 36.6,31.4 36.6,30.4 36.6,29.4 40.5,29.4 40.5,28.4 36.7,34.8 35.2,33.9 38,32.3 34.9,33.1 36,31.7 44.2,40.1 43.5,39.4 31.7,37.2 31.7,38.6 48.8,37.8 49.2,33.3 22.5,38.2 24.4,39.2 21.2,37.1 1.1,36.3 43.75,32.45 46.35,29.75 45.05,31.1 42.45,31.35 42.1,32.15 44.75,33.75 43.95,34 7.5,26.1 7.5,26.8 48.2,31.3 48.9,31.3 21.4,10 20.4,10 20.4,11 22.3,16.8 23.3,16.8 22.3,20.8 23.3,20.8 24.3,20.8 29.63,12.2 29.63,15.2 25.63,15.2 25.63,12.2 18.9,15.5 18.9,14.5 22.9,15.5 22.9,14.5 22.9,13.5 28.2,24.5 28.2,27.5 24.2,27.5 24.1,24.5 24,31.4 23.2,31.4 22.4,31.4 21.6,31.4 20.9,31.4 19.5,31.7 18.85,32.05 27.2,31.4 26.4,31.4 25.6,31.4 24.8,31.4 30.4,31.4 29.6,31.4 28.8,31.4 28,31.4 33.6,32 32.8,31.6 32,31.4 31.2,31.4 34.2,32.5 24.3,29.6 23.5,29.6 22.7,29.6 21.9,29.6 21.1,29.6 25.4,28.9 25.1,29.6 19.6,29.7 18.3,30.3 17.7,30.7 20.3,29.6 27.3,29.6 30.5,29.6 29.7,29.6 28.9,29.6 28.1,29.6 31.3,29.6 32.1,29.6 32.9,29.7 33.6,29.9 34.3,30.3 34.9,30.7 35.4,31.2 18.9,29.9 20.2,31.45 42.5,30 42.5,29.2 42.5,28.4 40.5,18.1 42,18.1 42.5,20.4 42.5,19.6 43,18.9 42.5,22.8 42.5,22 42.5,21.2 42.5,25.2 42.5,24.4 42.5,23.6 42.5,27.6 42.5,26.8 42.5,26 43.2,27.2 43.2,26.4 43.2,25.6 43.2,24.8 43.2,24 37.9,23.2 36.3,21.4 35.9,18.2 40.1,27.2 40.1,24.6 40,21.6 38.4,18.8 47.4,27.6 48.6,27.1 48.6,26.3 48.6,25.5 48.6,24.7 48.6,23.9 47.4,23.4 44.4,23.4 44.4,27.6 26.8,19.3 27.8,18.3 26.8,18.3 14.3,13.9 27,28.9 25.4,26.5 27,26.5 25.4,25.5 27,25.5 26.83,13.2 28.43,13.2 26.83,14.2 28.43,14.2 25.3,23.6 25.4,22.8 25.7,22.1 26.2,21.6 28.3,20.1 26.7,21.1 28.5,21.1 28.4,21.8 27.9,22.4 27.3,23 27.1,23.7 26.7,16.5 28.5,16 28.4,16.8 28.3,17.5 25.6,9.3 27.3,9.4 26.4,9.3 24,11.1 23.2,11.1 28.4,10.6 26.4,11.1 25.6,11.1 24.8,11.1 28.5,11.3 28,9.9 23.2,9.3 24.8,9.3 24,9.3 22.2,9.5 22.2,11.5 26.3,17.5 26.3,20.1 19.6,9.5 19.6,11.5 16.7,10 17.1,10.6 16.5,7.6 16.5,9.2 16.5,8.4 18.3,8.8 18.8,9.3 17.8,11 18.9,8 18.5,11.1 16.5,6 16.5,6.8 18.4,4.4 16.5,5.2 16.4,4.4 18.3,5.2 18.3,6.8 18.3,6 15,3.9 15,2.3 15,3.1 15,1.5 19.8,3.9 19.8,2.3 19.8,3.1 19.8,1.5 43.5,21.1 43.5,19.5 43.5,20.3 48.3,21.1 48.3,19.5 48.3,20.3 48.3,18.7 1.9,20.1 1.9,18.5 1.9,19.3 1.9,17.7 6.7,20.1 6.7,18.5 6.7,19.3 6.7,17.7 1.6,26.2 1.6,25.4 1.6,24.6 1.6,23.8 1.6,23 5.8,26.6 7,25.3 7,24.5 7,23.7 7,22.9 5.8,22.4 2.8,22.4 2.5,26.6 44.9,22.1 45,22.8 46.8,22.8 46.9,22.1 46.8,28.2 46.7,29 44.9,28.2 3.2,21 3.4,21.7 5.2,21.7 5.4,21 11.3,21.3 11.3,18.3 14.3,18.3 17.3,13.3 22.3,7.3 31.3,10.3 31.3,17.3 30.3,3.3 22.3,2.3 33.3,20.3 33.3,28.3 32.3,33.3 23.3,33.3 20.3,33.3 20.3,28.3 22.3,26.3 19.3,41.3 17.3,42.3
  pour Bottom (rank 6): -1.7,51.3 52.3,51.3 52.3,-0.7 -1.7,-0.7
  pour Top (rank 6): -2.7,52.3 53.3,52.3 53.3,-1.7 -2.7,-1.7
  pour Top (no thermals): 11.59,38.29 10.92,38.96 11.25,39.29 11.58,39.29 12.03,38.84 arc-45 11.92,38.58 11.63,38.29
  pour Top (no thermals): 5.1,26.3 6.7,26.3 6.7,22.7 5.1,22.7
  pour Top (no thermals): 1.9,26.3 3.5,26.3 3.5,22.7 1.9,22.7
  pour Top (no thermals): 46.7,27.3 48.3,27.3 48.3,27 48.3,23.7 46.7,23.7
  pour Top (no thermals): 43.5,27.3 45.1,27.3 45.1,27 45.1,23.7 43.5,23.7
  pour Top (no thermals): 46.7,21.1 47.9,21.1 47.9,18.5 46.7,18.5
  pour Top (no thermals): 43.9,21.1 45.1,21.1 45.1,18.5 43.9,18.5
  pour Top (no thermals): 5.1,20.1 6.3,20.1 6.3,17.5 5.1,17.5
  pour Top (no thermals): 2.3,20.1 3.5,20.1 3.5,17.5 2.3,17.5
  pour Top (no thermals): 18.8,10.68 18.8,11.46 23.09,11.46 23.09,10.68
  pour Top (no thermals): 27.12,16.65 26.34,16.65 26.34,20.94 27.12,20.94
  pour Top (no thermals): 15.4,3.9 16.6,3.9 16.6,1.3 15.4,1.3
  pour Top (no thermals): 18.2,3.9 19.4,3.9 19.4,1.3 18.2,1.3
LO_AMP1_IN
  Top 0.6: R10.1 L1.1 17.4,8.6
  Top 0.8: 17.4,8.6 17.4,9.17 arc-90 18.4,10.17 18.52,10.17
  pour Top (no thermals): 19.76,10.02 19.1,10.02 arc45 18.89,9.93 arc-45 18.5,9.77 18.5,10.57 arc-45 18.96,10.38 arc45 19.1,10.32 19.76,10.32
LO_AMP1_OUT
  Top 0.2: U7.5 23.32,10.17
  Top 0.8: 27.63,11.3 27.63,11.17 arc-90 26.63,10.17 23.32,10.17
  pour Top (no thermals): 22.04,10.32 22.7,10.32 arc45 22.91,10.41 arc-45 23.3,10.57 23.3,9.77 arc-45 22.84,9.96 arc45 22.7,10.02 22.04,10.02
  pour Top (no thermals): 27.23,11.3 27.23,11.6 arc90 26.93,11.9 26.93,12.5 26.98,12.5 arc90 27.33,12.85 27.33,13.4 27.93,13.4 27.93,12.85 arc90 28.28,12.5 28.33,12.5 28.33,11.9 arc90 28.03,11.6 28.03,11.3
LO_AMP2_IN
  pour Top (no thermals): 27.78,17.66 27.78,17 arc45 27.87,16.79 arc-45 28.03,16.4 27.23,16.4 arc-45 27.42,16.86 arc45 27.48,17 27.48,17.66
  pour Top (no thermals): 28.03,16.4 28.03,15.8 arc90 28.33,15.5 28.33,14.9 28.28,14.9 arc90 27.93,14.55 27.93,14 27.33,14 27.33,14.55 arc90 26.98,14.9 26.93,14.9 26.93,15.5 arc90 27.23,15.8 27.23,16.4
LO_AMP2_OUT
  Top 0.8: 27.63,21.2 arc45 27.44,21.66 26.49,22.61 arc-45 26.2,23.31 26.2,23.4
  pour Top (no thermals): 27.48,19.94 27.48,20.6 arc45 27.39,20.81 arc-45 27.23,21.2 28.03,21.2 arc-45 27.84,20.74 arc45 27.78,20.6 27.78,19.94
  pour Top (no thermals): 25.8,23.3 25.8,23.9 arc90 25.5,24.2 25.5,24.8 25.55,24.8 arc90 25.9,25.15 25.9,25.7 26.5,25.7 26.5,25.15 arc90 26.85,24.8 26.9,24.8 26.9,24.2 arc90 26.6,23.9 26.6,23.3
LO_AMP_VD1
  Top 0.305: U7.8 20.57,12.83 20.4,13 L2.2 C58.1
LO_AMP_VD2
  Top 0.305: U8.8 24.97,18.47 24.8,18.3 L3.2 C63.1
LO_IN
  Top 0.6: RFCON5.P$3 R10.2
LO_OUT
  pour Top (no thermals): 25.9,26.3 25.9,26.85 arc90 25.55,27.2 25.5,27.2 25.5,27.8 25.55,27.8 arc90 25.9,28.15 25.9,28.7 26.5,28.7 26.5,28.15 arc90 26.85,27.8 26.9,27.8 26.9,27.2 26.85,27.2 arc90 26.5,26.85 26.5,26.3
LO_SPLIT
  pour Top (no thermals): 25.9,29.3 25.9,29.85 arc90 25.55,30.2 25.5,30.2 25.5,30.8 26.9,30.8 26.9,30.2 26.85,30.2 arc90 26.5,29.85 26.5,29.3
N$5
  Top 0.2: U3.6 13.35,37.4 14.1,37.4 14.9,38.2 R3.2
N$6
  Top 0.2: U3.34 13.5,31.74 R5.2
N$9
  Top 0.254: U6.23 38.03,36 37.6,36 R8.2
N$11
  Top 0.6: U2.3 6.67,27.92 arc45 6.45,27.39 R1.2
N$13
  Top 0.6: R7.2 47.61,30.25 arc-45 47.08,30.47 U5.3
N$17
  Top 0.127: U3.15 9.05,37.6 8.8,37.6 6.2,40.2 5.1,40.2 R2.2
N$18
  Top 0.127: U3.16 6,39.95 3.95,39.95 R4.2
RX_GAIN_VCTRL
  Top 0.127: U6.14 42.5,37.76 42.5,38.29 43.01,38.8 43.9,38.8 45.4,40.3 48.05,40.3 49.15,41.4 P34.PAD_T
RX_IF
  Top 0.6: U5.1 45.61,29.14 arc-45 45.9,28.44 U4.1
RX_IF_FILT
  Top 0.6: RFCON3.P$3 U4.3
RX_IF_I
  Top 0.305: U6.4 42.58,32.87 arc-45 42.8,32.34 42.8,32.26 arc45 43.02,31.73 U5.6
RX_IF_Q
  Top 0.305: U6.6 43.34,33.52 arc45 43.87,33.3 43.94,33.3 arc-45 44.47,33.08 U5.4
RX_LO
  Top 0.8: 28.7,30.5 31.78,30.5 arc45 34.61,31.67 35.05,32.11 arc-45 36.47,32.7 36.65,32.7
  pour Top (no thermals): 38.7,34.19 38.2,33.69 arc-45 36.78,33.1 36.5,33.1 36.5,32.3 arc45 37.81,32.84 38.93,33.96
  pour Top (no thermals): 28.8,30.1 28.69,30.1 arc-5 28.51,30.11 27.5,30.2 27.5,30.8 28.51,30.89 arc-5 28.69,30.9 28.8,30.9
RX_LO_N
  Top 0.305: U6.26 38.22,34.19 arc-45 37.52,33.9 R9.2
RX_PWR_VDET
  Top 0.127: U6.11 43.36,36.5 44.5,36.5 45.3,37.3 48.45,37.3 48.85,36.9 P33.PAD_T
RX_RF
  Top 0.254: RFCON4.SIG 38.8,43.1
  Top 0.305: 39.53,38.03 U6.18
  Top 0.8: 38.8,42.5 38.8,39.6 arc45 39.39,38.18 39.53,38.03
  pour Top (no thermals): 40.11,37.23 39.86,37.48 arc45 39.5,37.63 arc-45 39.28,37.72 39.18,37.82 39.74,38.38 39.85,38.28 arc-45 39.94,38.06 arc45 40.09,37.7 40.33,37.45
  pour Top (no thermals): 38.4,42.5 39.2,42.5 39.2,42.64 arc45 39.05,42.99 39.03,43.01 arc-45 38.95,43.22 38.95,43.36 38.66,43.36 38.66,43.22 arc-45 38.57,43.01 38.55,42.99 arc45 38.4,42.64
  pour Top (no thermals): 38.4,42.5 39.2,42.5 39.2,42.64 arc45 39.05,42.99 39.03,43.01 arc-45 38.95,43.22 38.95,43.36 38.66,43.36 38.66,43.22 arc-45 38.57,43.01 38.55,42.99 arc45 38.4,42.64
RX_SPI_SCLK
  Top 0.127: U6.31 39.8,32.23 39.8,31.9 41.39,30.31 41.39,19.79 39.7,18.1 P36.PAD_T
RX_SPI_SDI
  Top 0.127: U6.32 41.65,31.01 41.65,18.65 41.2,18.2 P38.PAD_T
RX_SPI_SDO
  Top 0.127: U6.9 43.88,35.6 44.5,35.6 45.8,34.3 47.35,34.3 49.25,32.4 P37.PAD_T
TX_GAIN_VCTRL1
  Top 0.127: P1.PAD_T 1.05,42.9 1.75,42.2 3.1,42.2 R2.1
TX_GAIN_VCTRL2
  Top 0.127: R4.1 2.39,41.4 P2.PAD_T
TX_IF_FILT
  Top 0.6: U1.3 4.3,27.52 arc-45 4.89,28.94 U2.1
TX_IF_I
  Top 0.305: U3.30 10.6,31.12 arc-45 10.07,30.9 9.96,30.9 arc45 9.43,30.68 U2.4
TX_IF_IN
  Top 0.6: RFCON1.P$3 U1.1
TX_IF_Q
  Top 0.305: U3.24 8.42,33.18 arc45 8.2,32.65 8.2,32.56 arc-45 7.98,32.03 U2.6
TX_LO
  Top 0.8: 23.7,30.5 20.76,30.5 arc-45 17.93,31.67 16.79,32.81 arc45 15.37,33.4 15.3,33.4
  pour Top (no thermals): 14.1,34.19 14.2,34.09 arc45 14.9,33.8 15.4,33.8 15.4,33 15.22,33 arc-46 14.5,33.31 13.87,33.97
  pour Top (no thermals): 23.6,30.9 23.71,30.9 arc-5 23.89,30.89 24.9,30.8 24.9,30.2 23.89,30.11 arc-5 23.71,30.1 23.6,30.1
TX_LO_N
  Top 0.305: U3.37 14.1,33.26 14.1,33.1 R6.2
TX_PWR_VDET_N
  Top 0.127: U3.21 7.46,34.34 7.46,34.17 7.19,33.9 2.6,33.9 1.7,33 1.7,31.98 1.5,31.78 1.28,31.78 0.65,32.4 P4.PAD_T
TX_PWR_VDET_P
  Top 0.127: U3.22 7.82,33.99 7.64,33.99 7.3,33.65 2.7,33.65 1.95,32.9 1.95,31.87 1.61,31.52 1.28,31.52 0.65,30.9 P3.PAD_T
TX_RF
  Top 0.254: RFCON2.SIG 14.3,43
  Top 0.8: 14.3,42.5 14.3,42.13 arc-45 13.13,39.3 12.56,38.74
  pour Top (no thermals): 11.77,38.16 11.99,37.94 12.29,38.24 arc-45 12.51,38.33 arc45 12.87,38.48 12.95,38.56 12.38,39.13 12.23,38.78 arc45 12.16,38.7 arc-45 12.06,38.46
  pour Top (no thermals): 13.9,42.5 14.7,42.5 14.7,42.64 arc45 14.55,42.99 14.53,43.01 arc-45 14.45,43.22 14.45,43.36 14.15,43.36 14.15,43.22 arc-45 14.07,43.01 14.05,42.99 arc45 13.9,42.64
TX_SPI_SCLK
  Top 0.127: U3.3 15.11,37.05 18.06,37.05 18.71,37.69 21.11,37.69 23.32,39.9 P7.PAD_T
TX_SPI_SDI
  Top 0.127: U3.4 14.06,36.7 14.41,36.7 15.01,37.3 17.96,37.3 18.61,37.95 21,37.95 24.46,41.4 P9.PAD_T
TX_SPI_SDO
  Top 0.127: U3.5 13.65,37 14.35,37 14.9,37.55 17.85,37.55 18.5,38.2 20.9,38.2 24.2,41.5 24.2,42.05 25.05,42.9 P8.PAD_T

### Text on the board
tPlace: TX | RX | RXIF | TXIF | LO | IcyRadio / Exp. mmW Int. / RF / May 2024